# EAGLE schematic WaterLevel-Eagle-V1 (EAGLE 9.6.2)
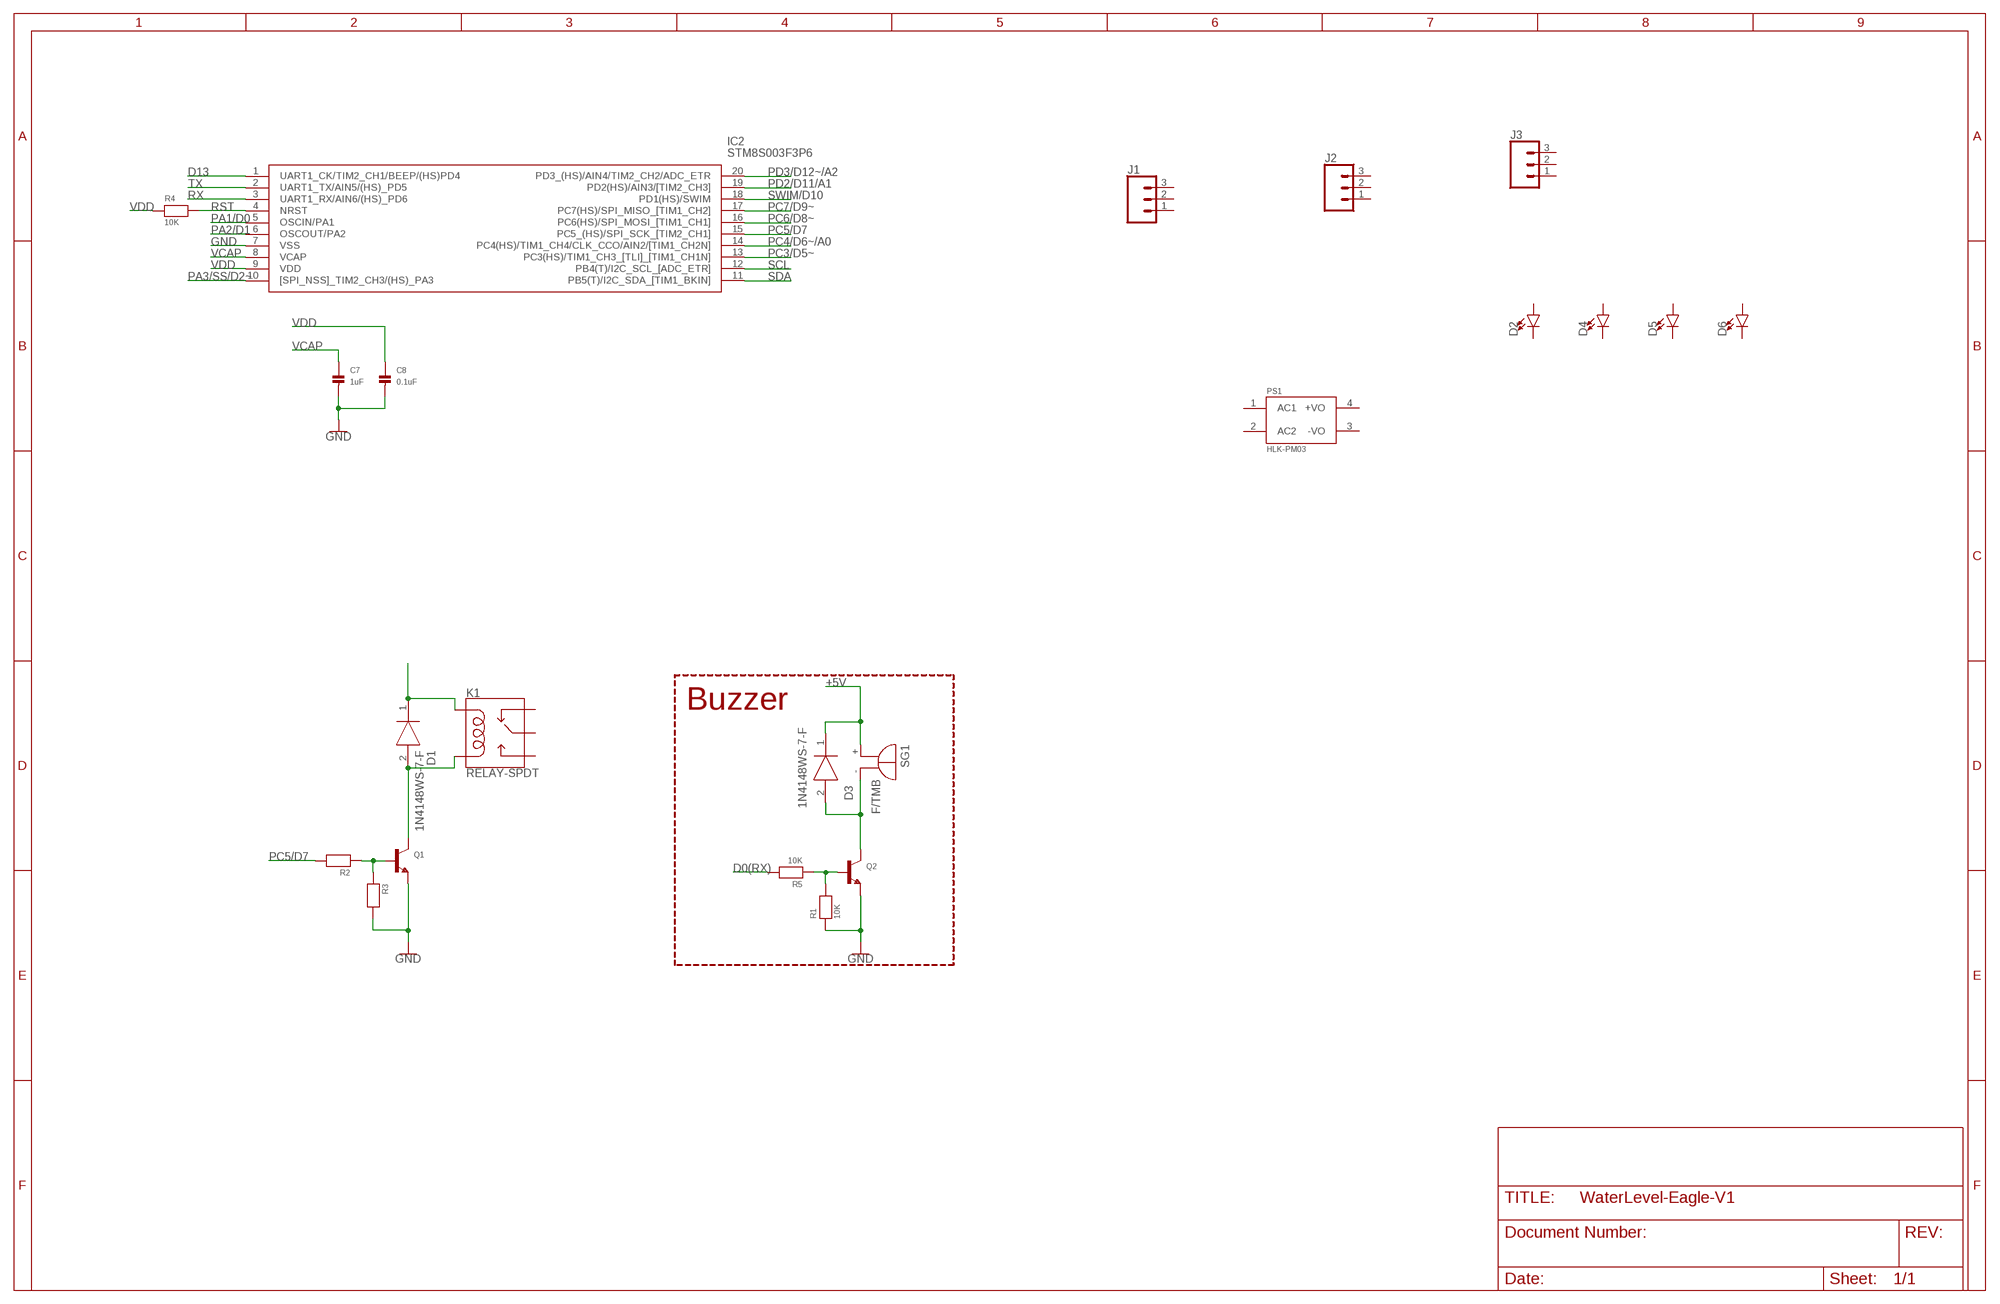
[diagram p0: schematic, sheet 1]

## Parts
C7  1uF  CAP_CERAMIC0805  [C0805]
C8  0.1uF  CAP_CERAMIC0805  [C0805]
D1  1N4148WS-7-F  [SOD2513X120N]
D2  LED-5MM-REC5MM  [LED_5MM]
D3  1N4148WS-7-F  [SOD2513X120N]
D4  LED-5MM-REC5MM  [LED_5MM]
D5  LED-5MM-REC5MM  [LED_5MM]
D6  LED-5MM-REC5MM  [LED_5MM]
IC2  STM8S003F3P6  [SOP65P640X120-20N]
J1  SCREW-CONN_03-SCREW-5MM  [SCREWTERMINAL-5MM-3]
J2  SCREW-CONN_03-SCREW-5MM  [SCREWTERMINAL-5MM-3]
J3  SCREW-CONN_03-SCREW-5MM  [SCREWTERMINAL-5MM-3]
K1  RELAY-SPDT  [RELAY_G5LE]
PS1  HLK-PM03  [CONV_HLK-PM03]
Q1  TRANSISTOR_NPNWIDE  [SOT23-WIDE]
Q2  TRANSISTOR_NPNWIDE  [SOT23-WIDE]
R1  10K  RESISTOR0603  [R0603]
R2  RESISTOR0805  [R0805]
R3  RESISTOR0805  [R0805]
R4  10K  RESISTOR0805  [R0805]
R5  10K  RESISTOR0603  [R0603]
SG1  F/TMB  [F/TMB]

## Nets
+5V: D3.1(K) SG1.+
D0(RX): R5.2
D13: IC2.1(UART1_CK/TIM2_CH1/BEEP/(HS)PD4)
GND: C7.2 C8.2 IC2.7(VSS) Q1.2(E) Q2.2(E) R1.1 R3.2
N$1: D1.1(K) K1.2(COIL1)
N$2: D1.2(A) K1.5(COIL2) Q1.3(C)
N$3: Q1.1(B) R2.1 R3.1
N$4: D3.2(A) Q2.3(C) SG1.-
N$5: Q2.1(B) R1.2 R5.1
PA1/D0: IC2.5(OSCIN/PA1)
PA2/D1: IC2.6(OSCOUT/PA2)
PA3/SS/D2~: IC2.10([SPI_NSS]_TIM2_CH3/(HS)_PA3)
PC3/D5~: IC2.13(PC3(HS)/TIM1_CH3_[TLI]_[TIM1_CH1N])
PC4/D6~/A0: IC2.14(PC4(HS)/TIM1_CH4/CLK_CCO/AIN2/[TIM1_CH2N])
PC5/D7: IC2.15(PC5_(HS)/SPI_SCK_[TIM2_CH1]) R2.2
PC6/D8~: IC2.16(PC6(HS)/SPI_MOSI_[TIM1_CH1])
PC7/D9~: IC2.17(PC7(HS)/SPI_MISO_[TIM1_CH2])
PD2/D11/A1: IC2.19(PD2(HS)/AIN3/[TIM2_CH3])
PD3/D12~/A2: IC2.20(PD3_(HS)/AIN4/TIM2_CH2/ADC_ETR)
RST: IC2.4(NRST) R4.2
RX: IC2.3(UART1_RX/AIN6/(HS)_PD6)
SCL: IC2.12(PB4(T)/I2C_SCL_[ADC_ETR])
SDA: IC2.11(PB5(T)/I2C_SDA_[TIM1_BKIN])
SWIM/D10: IC2.18(PD1(HS)/SWIM)
TX: IC2.2(UART1_TX/AIN5/(HS)_PD5)
VCAP: C7.1 IC2.8(VCAP)
VDD: C8.1 IC2.9(VDD) R4.1
Unconnected: D2.A D2.K(C) D4.A D4.K(C) D5.A D5.K(C) D6.A D6.K(C) J1.1 J1.2 J1.3 J2.1 J2.2 J2.3 J3.1 J3.2 J3.3 K1.1(MAIN) K1.3(NO) K1.4(NC) PS1.1(AC1) PS1.2(AC2) PS1.3(-VO) PS1.4(+VO)

## Notes on the sheet
- Buzzer

## Library data of the parts
C7 C8 = eventHorizon:CAP_CERAMIC: Ceramic Capacitors 0402 - 0402 Surface Mount Capacitors 16pF 50V 5% [Digikey: 445-4899-2-ND] 18pF 50V 5% [Digikey: 490-1281-2-ND] 22pF 50V 5% [Digikey: 490-1283-2-ND] 68pF 50V 5% [Digikey: 490-1289-2-ND] 0.1uF 10V 10% [Digikey: 490-1318-2-ND] 1.0uF 6.3V 10% [Digikey: 490-1320-2-ND] 0603 - 0603 Surface Mount Capacitors 16 pF 50V 5% [Digikey: 445-5051-2-ND] 22 pF 50V [Digikey: PCC220ACVTR-ND] 33 pF 50V 5% [Digikey: 490-1415-1-ND] 56pF 50V 5% [Digikey: 490-1421-1-ND] 220pF 50V 5% [Digikey: 445-1285-1-ND] 680 pF 50V 2200 pF 50V 5% C0G [Digikey: 445-1297-1-ND] 5600 pF 100V 5% X7R [Digikey: 478-3711-1-ND] 0.1 µF 25V 10% [Digikey: PCC2277TR-ND] 0.22 µF 16V 10% X7R [Digikey: 445-1318-1-ND] 1.0 µF 25V 10% [Digikey: 445-5146-2-ND] 0603 - RF Specific 3pF 250V +/-0.1pF RF [Digikey: 712-1347-1-ND] 18 pF 250V 5% [Digikey: 478-3505-1-ND or 712-1322-1-ND] 56 pF 250V 5% C0G RF [Digikey: 490-4867-1-ND] 68 pF 250V RF [Digikey: 490-4868-1-ND] 0805 - 0805 Surface Mount Capacitors 220 pF 250V 2% RF Ceramic Capacitor [Digikey: 712-1398-1-ND] 1000 pF 50V 2% NP0 Ceramic Capacitor [Digikey: 478-3760-1-ND] 0.1 µF 25V 10% Ceramic Capacitor [Digikey: PCC1828TR-ND] 1.0 µF 16V 10% Ceramic Capacitor[Digikey: 490-1691-2-ND] 10.0 µF 10V 10% Ceramic Capacitor[Digikey: 709-1228-1-ND] 10.0 uF 16V 10% Ceramic Capacitor [Digikey: 478-5165-2-ND] 47 uF 6.3V 20% Ceramic Capacitor [Digikey: 587-1779-1-ND or 399-5506-1-ND] 1206 - 1206 Surface Mount Capacitors 47uF 10V 20% Ceramic Capacitor [Digikey: 490-5528-1-ND or 399-5508-1-ND or 445-6010-1-ND] 100uF 6.3V -20%, +80% Y5V Ceramic Capacitor (Digikey: 490-4512-1-ND, Mouser: 81-GRM31CF50J107ZE1L)
D1 D3 = electroShri:1N4148WS-7-F: Diode Switching 150mA 75V 200mW SOD323 Diodes Inc 1N4148WS-7-F Switching Diode, 150mA 75V, 2-Pin SOD-323 Source: Datasheet <https://componentsearchengine.com/Datasheets/2/1N4148WS-7-F.pdf>; ARROW_PART_NUMBER: 1N4148WS-7-F; ARROW_PRICE-STOCK: https://www.arrow.com/en/products/1n4148ws-7-f/diodes-incorporated; DESCRIPTION: Diode Switching 150mA 75V 200mW SOD323 Diodes Inc 1N4148WS-7-F Switching Diode, 150mA 75V, 2-Pin SOD-323; HEIGHT: 1.2mm; MANUFACTURER_NAME: Diodes Inc.; MANUFACTURER_PART_NUMBER: 1N4148WS-7-F; MOUSER_PART_NUMBER: 621-1N4148WS-F; MOUSER_PRICE-STOCK: https://www.mouser.co.uk/ProductDetail/Diodes-Incorporated/1N4148WS-7-F?qs=4drIV0IxA0r8aNy7%2Fu4kVw%3D%3D
D2 D4-D6 = electroShri:LED-5MM-REC: LED (Generic) Standard schematic elements and footprints for 5mm, 3mm, 1206, and 0603 sized LEDs. Generic LEDs with no color specified.
IC2 = electroShri:STM8S003F3P6: STMICROELECTRONICS - STM8S003F3P6 - MCU, 8BIT, STM8, 16MHZ, TSSOP-20 Source: Datasheet <http://www.st.com/web/en/resource/technical/document/datasheet/DM00024550.pdf>; ARROW_PART_NUMBER: STM8S003F3P6; ARROW_PRICE-STOCK: https://www.arrow.com/en/products/stm8s003f3p6/stmicroelectronics; DESCRIPTION: STMICROELECTRONICS - STM8S003F3P6 - MCU, 8BIT, STM8, 16MHZ, TSSOP-20; HEIGHT: 1.2mm; MANUFACTURER_NAME: STMicroelectronics; MANUFACTURER_PART_NUMBER: STM8S003F3P6; MOUSER_PART_NUMBER: 511-STM8S003F3P6; MOUSER_PRICE-STOCK: https://www.mouser.co.uk/ProductDetail/STMicroelectronics/STM8S003F3P6?qs=vV0pr1uq7fD%252BGii5YhjnYw%3D%3D
J1-J3 = electroShri:SCREW-CONN_03: Multi connection point. Often used as Generic Header-pin footprint for 0.1 inch spaced/style header connections On any of the 0.1 inch spaced packages, you can populate with these: Break Away Headers - Straight <https://www.sparkfun.com/products/116> (PRT-00116) Break Away Male Headers - Right Angle <https://www.sparkfun.com/products/553> (PRT-00553) Female Headers <https://www.sparkfun.com/products/115> (PRT-00115) Break Away Headers - Machine Pin <https://www.sparkfun.com/products/117> (PRT-00117) Break Away Female Headers - Swiss Machine Pin <https://www.sparkfun.com/products/743> (PRT-00743) Stackable Header - 3 Pin (Female, 0.1") <https://www.sparkfun.com/products/13875> (PRT-13875) For SCREWTERMINALS and SPRING TERMINALS visit here: Screw Terimnals on SparkFun.com <https://www.sparkfun.com/search/results?term=Screw+Terminals> (5mm/3.5mm/2.54mm spacing) This device is also useful as a general connection point to wire up your design to another part of your project. Our various solder wires solder well into these plated through hole pads. Hook-Up Wire - Assortment (Stranded, 22 AWG) <https://www.sparkfun.com/products/11375> (PRT-11375) Hook-Up Wire - Assortment (Solid Core, 22 AWG) <https://www.sparkfun.com/products/11367> (PRT-11367) View the entire wire category on our website here <https://www.sparkfun.com/categories/141> Special notes: Molex polarized connector foot print use with SKU : PRT-08232 with associated crimp pins and housings.; PROD_ID: CONN-10134; SF_SKU: PRT-08433
K1 = electroShri:RELAY-SPDT: SPDT Electromechanical Relay Single-pole, double-throw sealed relays. When current is applied to the coil, it throws a simple changeover switch, terminating the connection from the NC contact to ground and closing the NO contact. Use them to switch high voltage/high current devices. SparkFun Products JQX-15F: Relay SPDT Sealed - 20A <https://www.sparkfun.com/products/10924> (COM-10924) JZC-11F: Relay SPDT Sealed <https://www.sparkfun.com/products/100> (COM-00100); PROD_ID: COMP-14214
PS1 = electroShri:HLK-PM03: AC DC 3W power module; AVAILABILITY: Unavailable; MF: Hi-link; MP: HLK-PM03; PACKAGE: Package; PRICE: None
Q1 Q2 = eventHorizon:TRANSISTOR_NPN: NPN Transistor Transistor (NPN) 500mA 45V - BC817 [Digikey: 568-1631-1-ND] Transistor (NPN) 500mA 45V - BC817,215 [Mouser: 771-BC817-T/R] SOT23-R - SOT23 footprint optimised for use with solder paste and reflow ovens. SOT23-W - SOT23 footprint optimised for hand-soldering (larger pads).
R1-R5 = eventHorizon:RESISTOR: Resistors 0402 - 0402 Surface Mount Package 22 Ohm 1% 1/16W [Digikey: 311-22.0LRTR-ND] 33 Ohm 5% 1/16W 1.0K 5% 1/16W 1.5K 5% 1/16W 2.0K 1% 1/16W 10.0K 1% 1/16W [Digikey: 311-10.0KLRTR-ND] 10.0K 5% 1/16W [Digikey: RMCF0402JT10K0TR-ND] 12.1K 1% 1/16W [Digikey: 311-22.0LRTR-ND] 100.0K 5% 1/16W 0603 - 0603 Surface Mount Package 0 Ohm 1/10 Watt 1% Resistor 15 Ohm 1/10 Watt 1% Resistor 33 Ohm 1/10 Watt 1% Resistor 49.9 Ohm 1/10 Watt 1% Resistor 100 Ohm 1/10 Watt 1% Resistor 150 Ohm 1/10 Watt 1% Resistor 240 Ohm 1/10 Watt 1% Resistor 390 Ohm 1/10 Watt 1% Resistor 560 Ohm 1/10 Watt 1% Resistor 680 Ohm 1/10 Watt 1% Resistor 750 Ohm 1/10 Watt 1% Resistor 1.0K Ohm 1/10 Watt 1% Resistor 1.5K Ohm 1/10 Watt 1% Resistor 2.0K Ohm 1/10 Watt 1% Resistor 2.2K Ohm 1/10 Watt 1% Resistor 3.3K Ohm 1/10 Watt 1% Resistor 4.7K Ohm 1/10 Watt 1% Resistor 10.0K Ohm 1/10 Watt 1% Resistor 12.0K Ohm 1/10 Watt 1% Resistor 12.1K Ohm 1/10 Watt 1% Resistor 20.0K Ohm 1/10 Watt 1% Resistor 33.0K Ohm 1/10 Watt 1% Resistor 100.0K Ohm 1/10 Watt 1% Resistor 0805 - 0805 Surface Mount Package 0 Ohm 1/8 Watt 1% Resistor 33 Ohm 1/8 Watt 1% Resistor 100 Ohm 1/8 Watt 1% Resistor 150 Ohm 1/8 Watt 1% Resistor 200 Ohm 1/8 Watt 1% Resistor 240 Ohm 1/8 Watt 1% Resistor 330 Ohm 1/8 Watt 1% Resistor 390 Ohm 1/8 Watt 1% Resistor 470 Ohm 1/8 Watt 1% Resistor 1.0K Ohm 1/8 Watt 1% Resistor 1.5K Ohm 1/8 Watt 1% Resistor 2.0K Ohm 1/8 Watt 1% Resistor 4.7K Ohm 1/8 Watt 1% Resistor 5.1K Ohm 1/8 Watt 1% Resistor 5.6K Ohm 1/8 Watt 1% Resistor 10.0K Ohm 1/8 Watt 1% Resistor 22.0K Ohm 1/8 Watt 1% Resistor 33.0K Ohm 1/8 Watt 1% Resistor 100K Ohm 1/8 Watt 1% Resistor 1206 - 1206 Surface Mount Package 2012 - 2010 Surface Mount Package 0.11 Ohm 1/2 Watt 1% Resistor - Digikey: RHM.11UCT-ND
SG1 = eventHorizon:F/TMB: BUZZER Source: Buerklin; OC_FARNELL: unknown; OC_NEWARK: unknown

## Net classes
0 default: width 0.203 mm, drill 0.356 mm, clearance 0.254 mm